# EAGLE design multitask_attiny85_no_icsp (EAGLE 6.1)
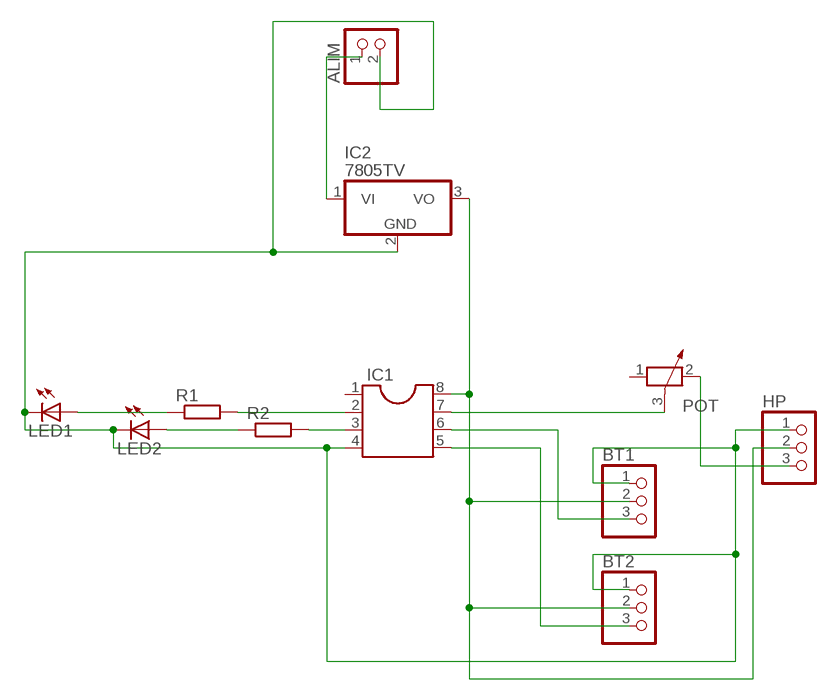
[diagram p0: schematic, sheet 1]

## Parts
ALIM  PINHD-1X2  [1X02]
BT1  PINHD-1X3  [1X03]
BT2  PINHD-1X3  [1X03]
HP  PINHD-1X3  [1X03]
IC1  DIL8S  [SOCKET-08]
IC2  7805TV  [TO220V]
LED1  LED5MM  [LED5MM]
LED2  LED5MM  [LED5MM]
POT  POTENTIOMETER_PT-10  [PT-10]
R1  R-EU_0204/7  [0204/7]
R2  R-EU_0204/7  [0204/7]

## Nets
N$1: LED1.A R1.1
N$2: LED2.A R2.1
N$3: IC1.3 R2.2
N$4: IC1.2 R1.2
N$5: BT1.2 BT2.2 HP.2 IC1.8 IC2.3(VO)
N$6: ALIM.2 BT1.1 BT2.1 HP.1 IC1.4 IC2.2(GND) LED1.K(C) LED2.K(C)
N$7: IC1.7 POT.3
N$8: BT1.3 IC1.6
N$9: BT2.3 IC1.5
N$10: HP.3 POT.2
N$12: ALIM.1 IC2.1(VI)
Unconnected: IC1.1 POT.1

## Library data of the parts
ALIM = pinhead:PINHD-1X2: PIN HEADER
BT1 BT2 HP = pinhead:PINHD-1X3: PIN HEADER
IC1 = ic-package:DIL8: Dual In Line / Socket
IC2 = linear:78*: Positive VOLTAGE REGULATOR Source: http://cache.national.com/ds/LM/LM78L05.pdf http://www.fairchildsemi.com/ds/LM/LM7805.pdf
LED1 LED2 = led:LED: LED OSRAM: - CHIPLED LG R971, LG N971, LY N971, LG Q971, LY Q971, LO R971, LY R971 LH N974, LH R974 LS Q976, LO Q976, LY Q976 LO Q996 - Hyper CHIPLED LW Q18S LB Q993, LB Q99A, LB R99A - SideLED LS A670, LO A670, LY A670, LG A670, LP A670 LB A673, LV A673, LT A673, LW A673 LH A674 LY A675 LS A676, LA A676, LO A676, LY A676, LW A676 LS A679, LY A679, LG A679 - Hyper Micro SIDELED® LS Y876, LA Y876, LO Y876, LY Y876 LT Y87S - SmartLED LW L88C, LW L88S LB L89C, LB L89S, LG L890 LS L89K, LO L89K, LY L89K LS L896, LA L896, LO L896, LY L896 - TOPLED LS T670, LO T670, LY T670, LG T670, LP T670 LSG T670, LSP T670, LSY T670, LOP T670, LYG T670 LG T671, LOG T671, LSG T671 LB T673, LV T673, LT T673, LW T673 LH T674 LS T676, LA T676, LO T676, LY T676, LB T676, LH T676, LSB T676, LW T676 LB T67C, LV T67C, LT T67C, LS T67K, LO T67K, LY T67K, LW E67C LS E67B, LA E67B, LO E67B, LY E67B, LB E67C, LV E67C, LT E67C LW T67C LS T679, LY T679, LG T679 LS T770, LO T770, LY T770, LG T770, LP T770 LB T773, LV T773, LT T773, LW T773 LH T774 LS E675, LA E675, LY E675, LS T675 LS T776, LA T776, LO T776, LY T776, LB T776 LHGB T686 LT T68C, LB T68C - Hyper Mini TOPLED® LB M676 - Mini TOPLED Santana® LG M470 LS M47K, LO M47K, LY M47K Source: http://www.osram.convergy.de LUXEON: - LUMILED® LXK2-PW12-R00, LXK2-PW12-S00, LXK2-PW14-U00, LXK2-PW14-V00 LXK2-PM12-R00, LXK2-PM12-S00, LXK2-PM14-U00 LXK2-PE12-Q00, LXK2-PE12-R00, LXK2-PE12-S00, LXK2-PE14-T00, LXK2-PE14-U00 LXK2-PB12-K00, LXK2-PB12-L00, LXK2-PB12-M00, LXK2-PB14-N00, LXK2-PB14-P00, LXK2-PB14-Q00 LXK2-PR12-L00, LXK2-PR12-M00, LXK2-PR14-Q00, LXK2-PR14-R00 LXK2-PD12-Q00, LXK2-PD12-R00, LXK2-PD12-S00 LXK2-PH12-R00, LXK2-PH12-S00 LXK2-PL12-P00, LXK2-PL12-Q00, LXK2-PL12-R00 Source: www.luxeon.com KINGBRIGHT: KA-3528ASYC Source: www.kingbright.com
POT = rcl:POTENTIOMETER_: Potentiometer
R1 R2 = resistor:R-EU_: RESISTOR, European symbol

## Board
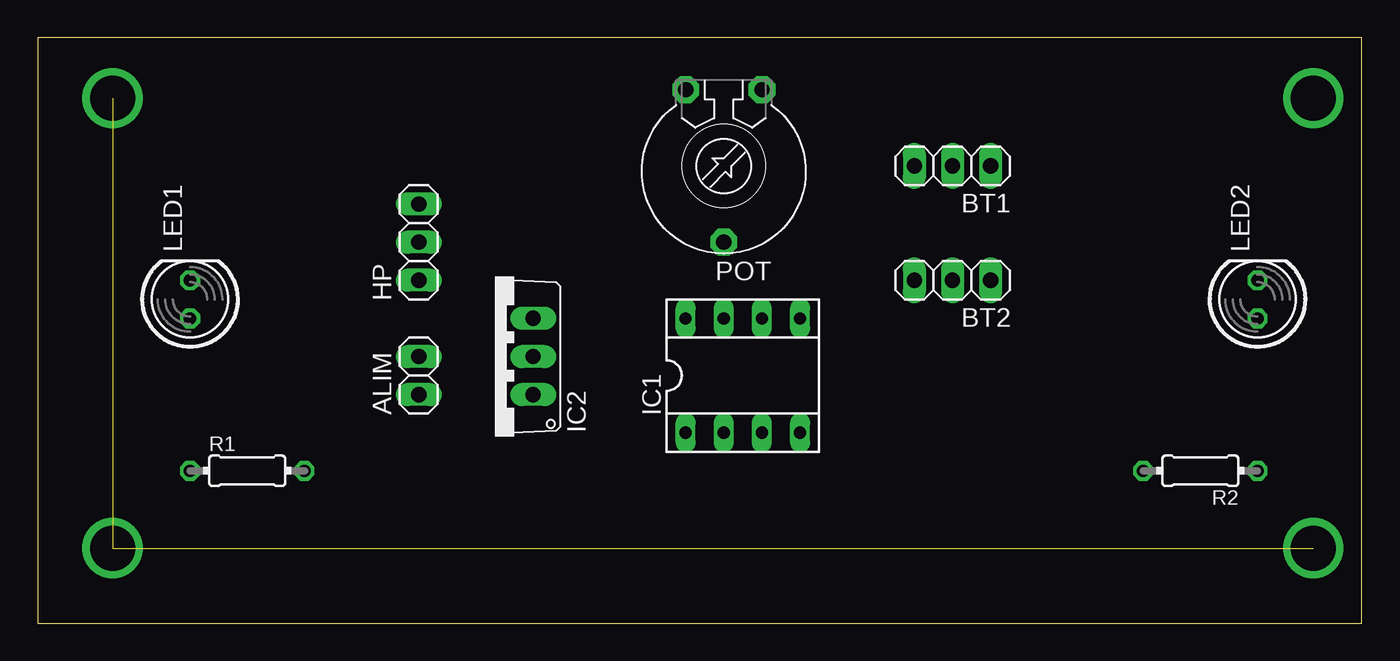
[diagram p1: board, top side]
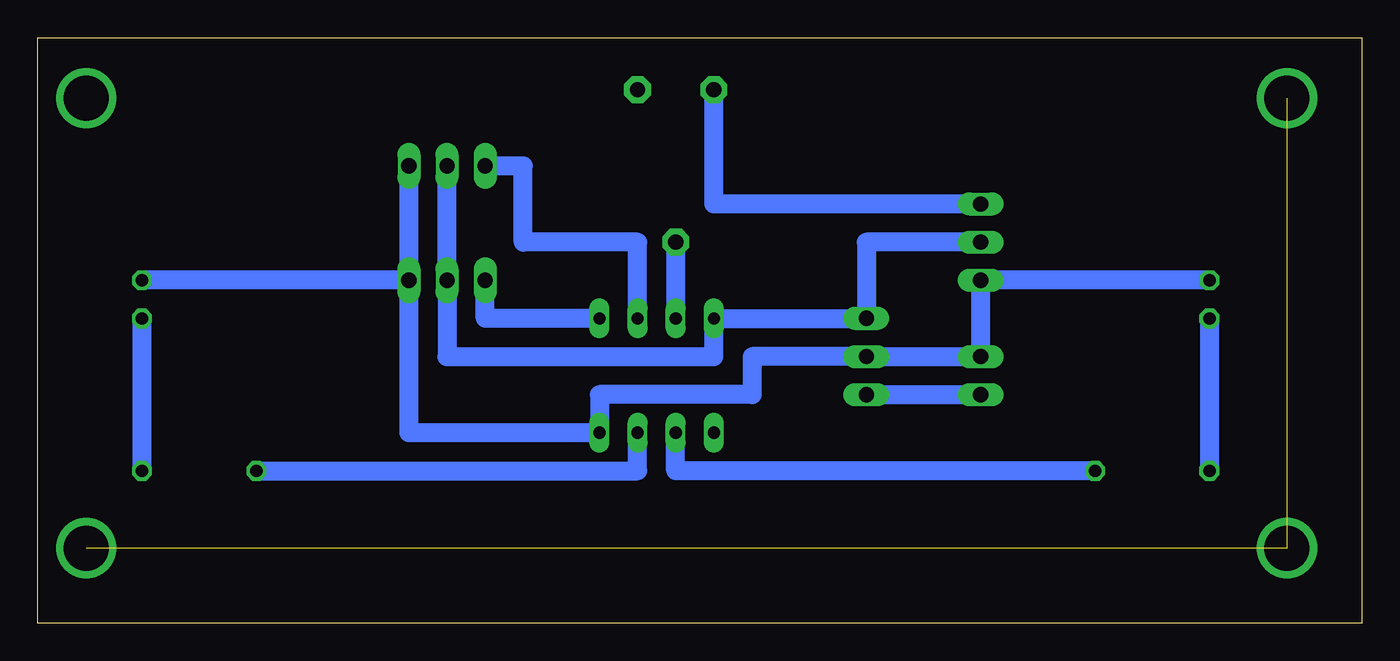
[diagram p2: board, bottom side, seen from below]

Size 88.24 x 39.04 mm. Coordinates in mm from the lower left corner, seen from the top.
Outline: 0,0 88.24,0 88.24,39.04 0,39.04 0,0
Copper layers (1*16): Top 0.035mm / dielectric 1.5mm / Bottom 0.035mm
Design rules: minimum track width 10mil, minimum drill 24mil, track to track 8mil, track to pad 8mil, pad to pad 8mil, via to via 8mil, smd to smd 8mil, copper to edge 40mil, drill to drill 8mil, minimum pad ring 10mil, minimum via ring 8mil, stop-mask expansion 4mil, vias tented up to drill 0mil, thermal gap 10mil

### Footprints (pad centres in the part's own frame; a part is rotated, then mirrored left to right if it is on the bottom)
1X02 = drill 1.016 long: 1 -1.27,0; 2 1.27,0
1X03 = drill 1.016 long: 1 -2.54,0; 2 0,0; 3 2.54,0
SOCKET-08 = drill 0.813 long: 1 -3.81,-3.81; 2 -1.27,-3.81; 3 1.27,-3.81; 4 3.81,-3.81; 5 3.81,3.81; 6 1.27,3.81; 7 -1.27,3.81; 8 -3.81,3.81
TO220V = drill 1.016 long: 1 -2.54,-2.54; 2 0,-2.54; 3 2.54,-2.54
LED5MM = drill 0.813 octagon: A -1.27,0; K 1.27,0
PT-10 = drill 1.016 pad 1.778 octagon: 1 -2.54,-5.08; 2 2.54,-5.08; 3 0,5.08
0204/7 = drill 0.813 octagon: 1 -3.81,0; 2 3.81,0

### Placement (x,y rotation side)
ALIM  25.4,16.51 90 top
BT1  60.96,30.48 180 top
BT2  60.96,22.86 180 top
HP  25.4,25.4 90 top
IC1  46.99,16.51 0 top
IC2  30.48,17.78 90 top
LED1  10.16,21.59 90 top
LED2  81.28,21.59 90 top
POT  45.72,30.48 180 top
R1  13.97,10.16 0 top
R2  77.47,10.16 180 top

### Tracks (layer width: path | path; a pad name or v marks a point on that pad's centre or on a via)
N$1
  Bottom 1.27: LED1.A R1.1
N$2
  Bottom 1.27: R2.1 LED2.A
N$3
  Bottom 1.27: R2.2 48.26,10.16 IC1.3
N$4
  Bottom 1.27: R1.2 45.72,10.16 IC1.2
N$5
  Bottom 1.27: BT1.2 BT2.2 60.96,17.78 43.18,17.78 IC1.8 IC2.3 33.02,25.4 HP.2
N$6
  Bottom 1.27: BT2.1 63.5,12.7 IC1.4 50.8,15.24 40.64,15.24 40.64,17.78 IC2.2 ALIM.2 HP.1 LED1.K | BT2.1 BT1.1 | BT2.1 LED2.K
N$7
  Bottom 1.27: POT.3 IC1.7
N$8
  Bottom 1.27: IC1.6 48.26,25.4 55.88,25.4 55.88,30.48 BT1.3
N$9
  Bottom 1.27: IC1.5 58.42,20.32 BT2.3
N$10
  Bottom 1.27: HP.3 43.18,27.94 POT.2
N$12
  Bottom 1.27: IC2.1 ALIM.1
N$13  (via drill 3)  (2 unrouted)
  other vias: 5,5 5,35 85,5
N$14  (via drill 3)
  other vias: 85,35